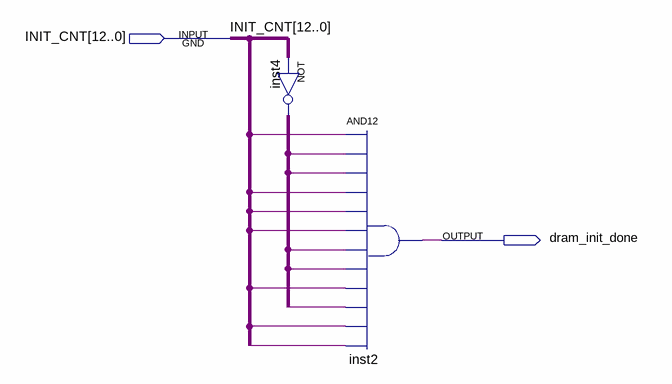
[diagram p0: schematic sheet]
// Quartus schematic dram_init_done.bdf as structural Verilog: 2 symbols, 2 pins
module dram_init_done (
  input  [12:0] INIT_CNT,
  output dram_init_done
);

  wire [12:0] nINIT_CNT;

  assign nINIT_CNT = ~INIT_CNT;  // NOT inst4, 13 bits wide
  and inst2 (dram_init_done, INIT_CNT[12], nINIT_CNT[11], nINIT_CNT[10], INIT_CNT[9], INIT_CNT[8], INIT_CNT[7], nINIT_CNT[6], nINIT_CNT[5], INIT_CNT[4], nINIT_CNT[3], INIT_CNT[2], INIT_CNT[1]);
endmodule
